# Altium schematic sheet [02] - BLOCK DIAGRAM.SchDoc
size A3; DocumentNumber: 2; SheetNumber: 2; SheetTotal: 20
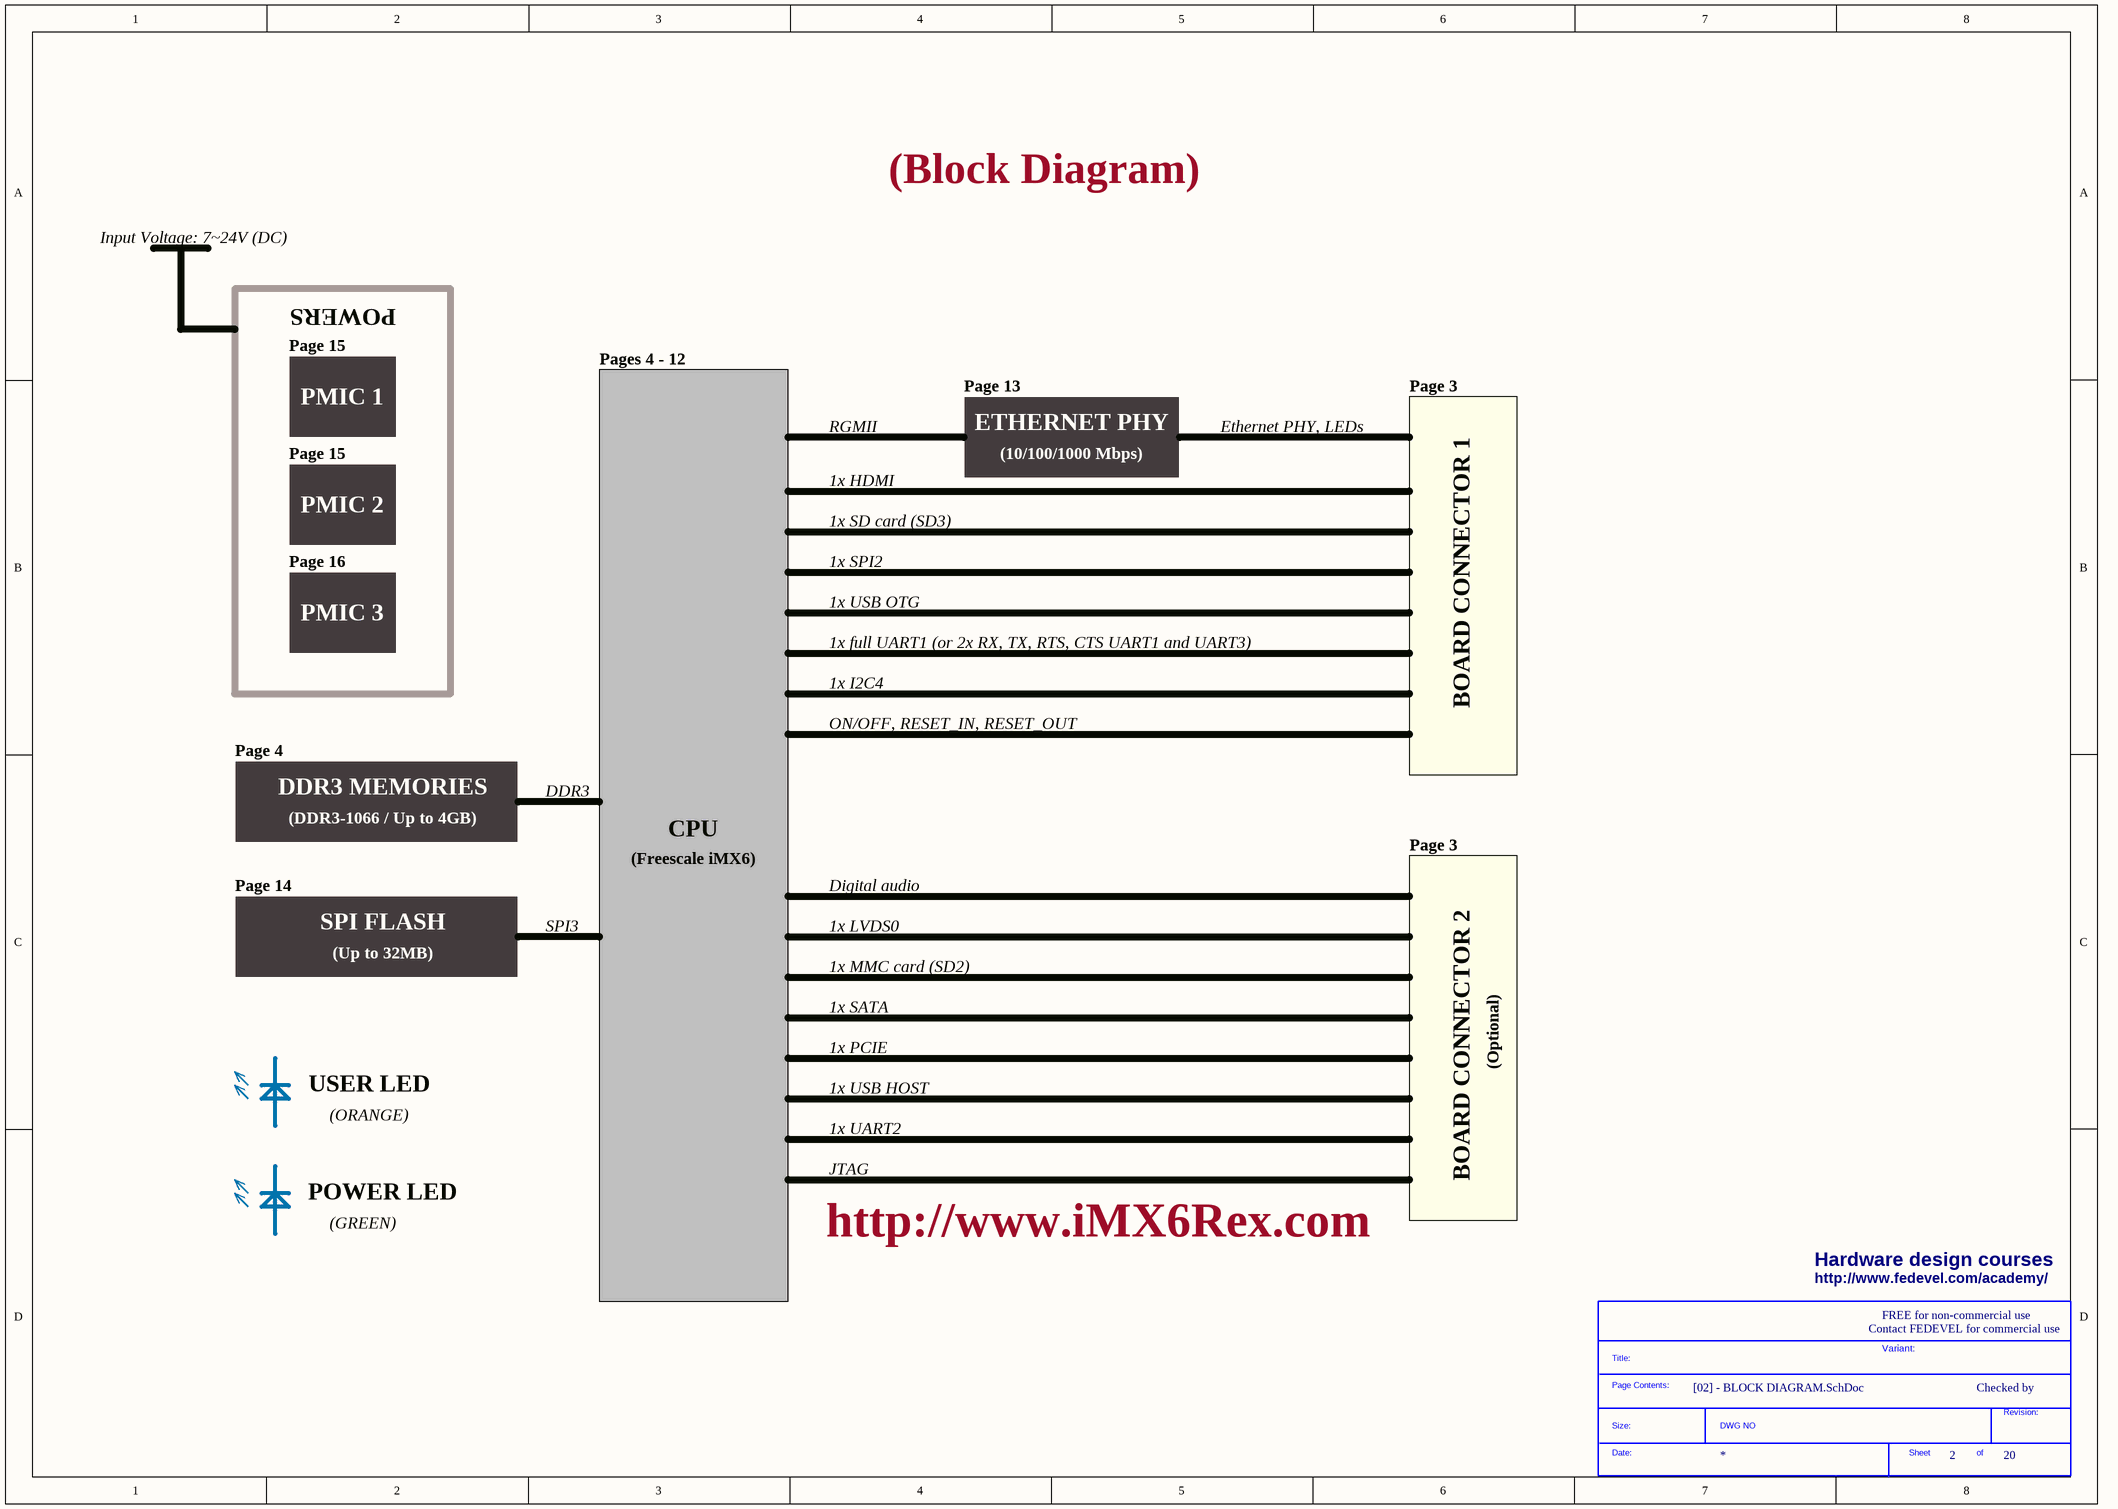
[diagram p0: [02] - BLOCK DIAGRAM.SchDoc]

## Parts
*  SDTitleBlock  (value not drawn)  (graphical)

## Notes on the sheet
- Input Voltage: 7~24V (DC)
- (Block Diagram)
- POWERS
- Page 15
- Pages 4 - 12
- PMIC 1
- RGMII
- Page 13
- ETHERNET PHY
- Ethernet PHY, LEDs
- Page 3
- PMIC 2
- 1x HDMI
- (10/100/1000 Mbps)
- Page 16
- 1x SD card (SD3)
- 1x SPI2
- BOARD CONNECTOR 1
- PMIC 3
- 1x USB OTG
- 1x full UART1 (or 2x RX, TX, RTS, CTS UART1 and UART3)
- 1x I2C4
- Page 4
- ON/OFF, RESET_IN, RESET_OUT
- DDR3 MEMORIES
- (DDR3-1066 / Up to 4GB)
- DDR3
- CPU
- Page 14
- (Freescale iMX6)
- Digital audio
- SPI FLASH
- (Up to 32MB)
- SPI3
- 1x LVDS0
- 1x MMC card (SD2)
- 1x SATA
- 1x PCIE
- BOARD CONNECTOR 2
- (Optional)
- (ORANGE)
- USER LED
- 1x USB HOST
- 1x UART2
- JTAG
- (GREEN)
- POWER LED
- http://www.iMX6Rex.com
- Hardware design courses
- http://www.fedevel.com/academy/
- Contact FEDEVEL for commercial use
- FREE for non-commercial use
- Variant:
- Checked by
- (in symbol SDTitleBlock) Title:; Page Contents:; Revision:; Size:; DWG NO; Date:; Sheet; of